# EAGLE design Scheffknecht_input_switch (EAGLE 9.6.2)
BRD_SHEET_NAME: Schaltplan; PROJEKT_NAME: Verstärker_Innovativwoche; REVISION: 1.0; SCH_SHEET_NAME: Input switcher; USER_NAME: Scheffknecht/Melcher-Millner

## Sheet 1 of 3: Input Switch
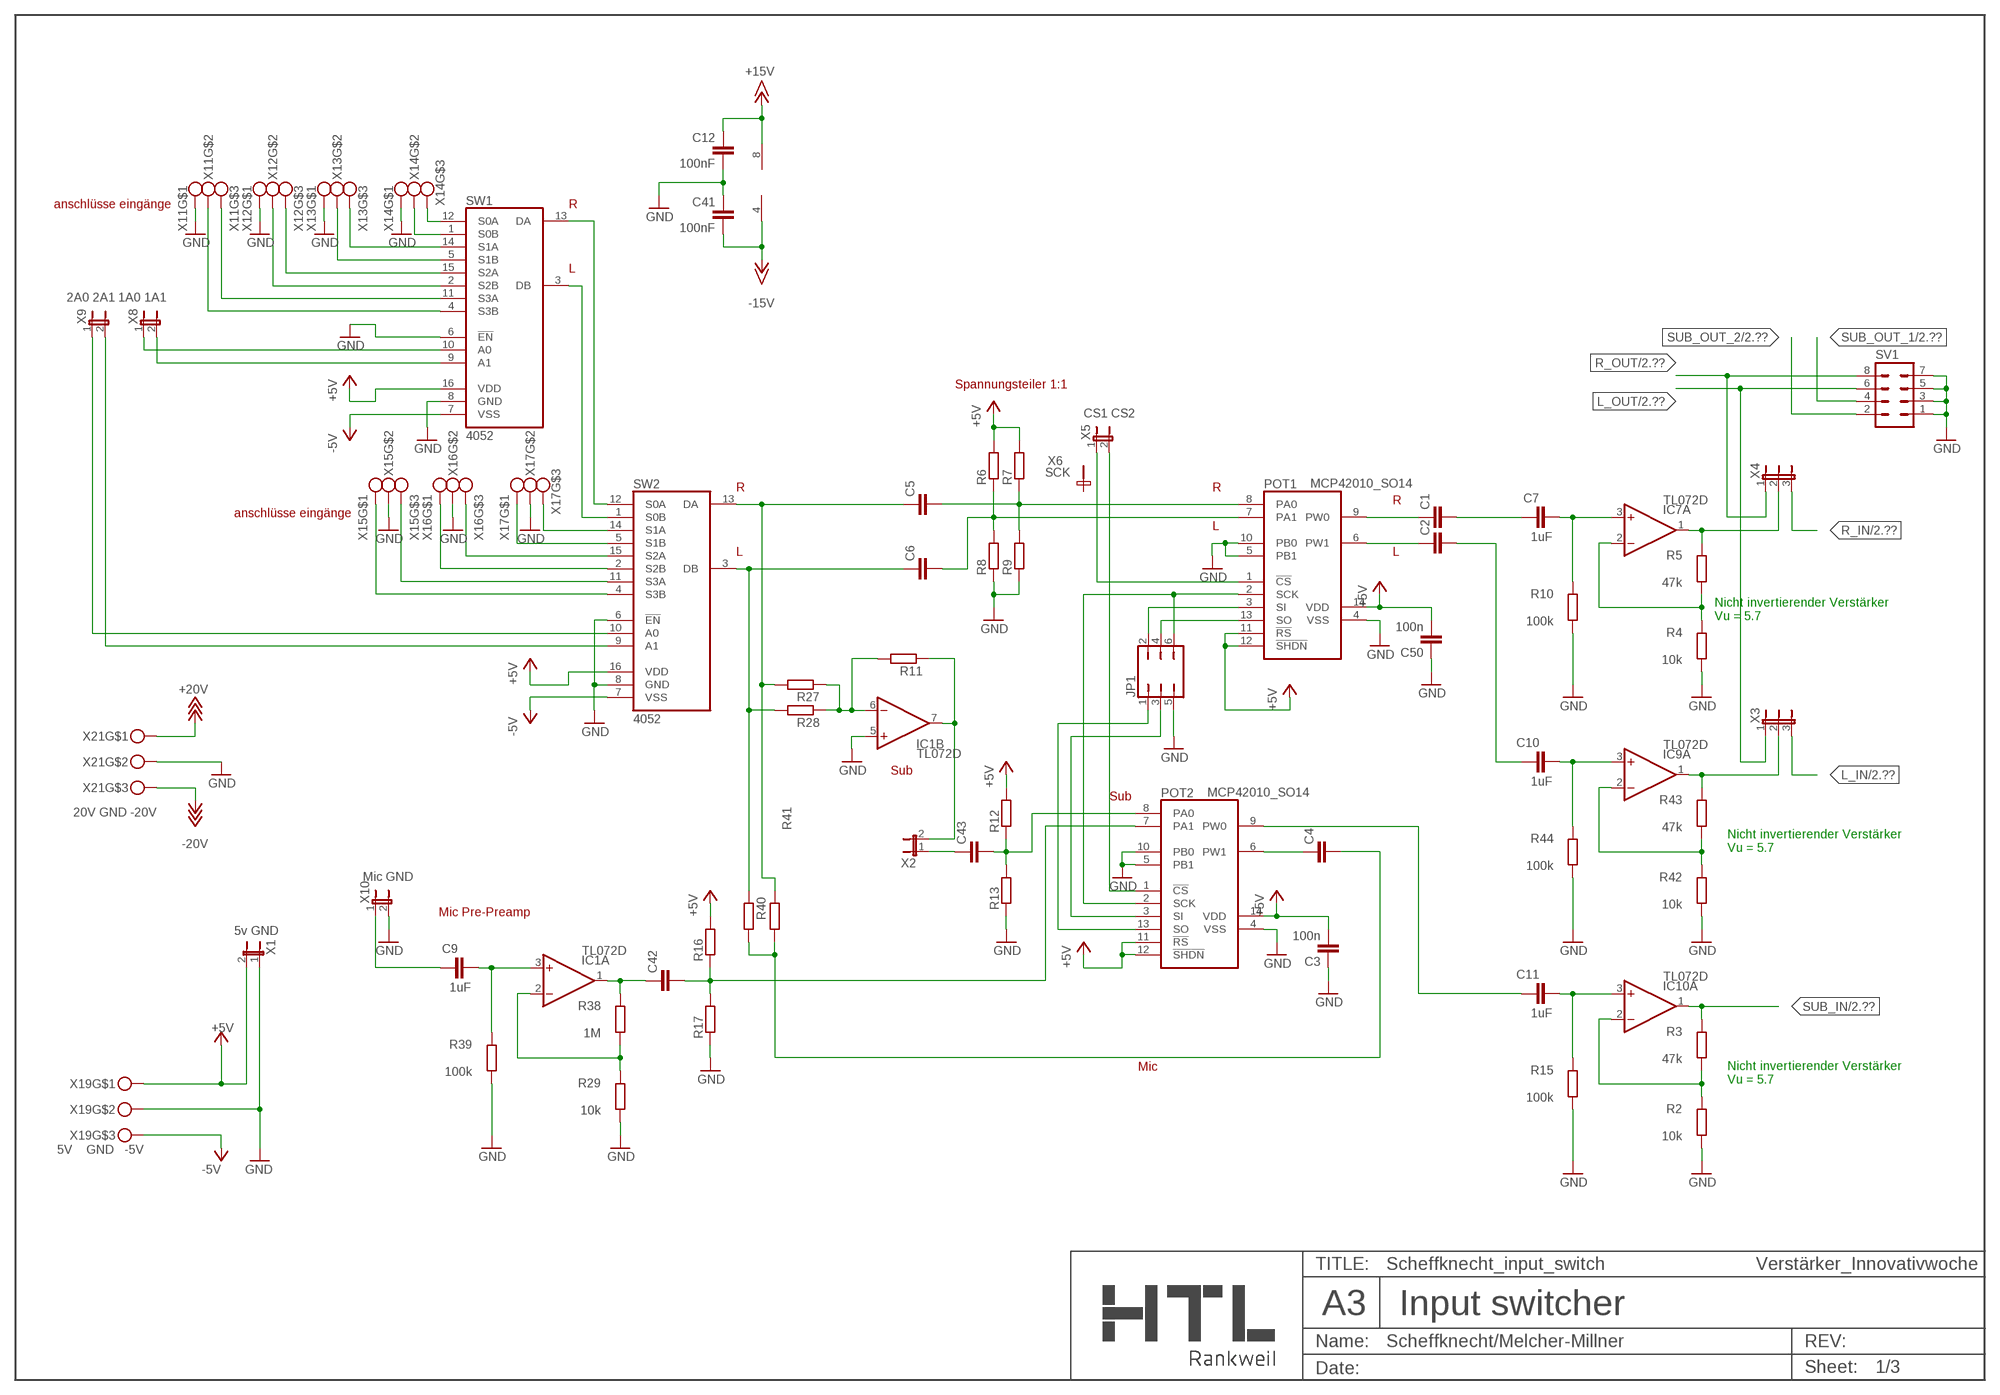
[diagram p0: schematic, sheet 1]

### Parts
C1  C-EUC0805  [C0805]
C2  C-EUC0805  [C0805]
C3  100n  C-EUC0805  [C0805]
C4  C-EUC0805  [C0805]
C5  C-EUC0805  [C0805]
C6  C-EUC0805  [C0805]
C7  1uF  C-EU025-025X050  [C025-025X050]
C9  1uF  C-EU025-025X050  [C025-025X050]
C10  1uF  C-EU025-025X050  [C025-025X050]
C11  1uF  C-EU025-025X050  [C025-025X050]
C12  100nF  C-EUC0805  [C0805]
C41  100nF  C-EUC0805  [C0805]
C42  C-EUC0805  [C0805]
C43  C-EUC0805  [C0805]
C50  100n  C-EUC0805  [C0805]
FRAME1  HTL-A3-H  [HTL-LEER]
IC1  TL072D  [SO08]
IC7  TL072D  [SO08]
IC9  TL072D  [SO08]
IC10  TL072D  [SO08]
JP1  JP3Q  [JP3Q]
POT1  MCP42010_SO14  [SO14]
POT2  MCP42010_SO14  [SO14]
R2  10k  R-EU_M0805  [M0805]
R3  47k  R-EU_M0805  [M0805]
R4  10k  R-EU_M0805  [M0805]
R5  47k  R-EU_M0805  [M0805]
R6  R-EU_M0805  [M0805]
R7  R-EU_M0805  [M0805]
R8  R-EU_M0805  [M0805]
R9  R-EU_M0805  [M0805]
R10  100k  R-EU_M0805  [M0805]
R11  R-EU_M0805  [M0805]
R12  R-EU_M0805  [M0805]
R13  R-EU_M0805  [M0805]
R15  100k  R-EU_M0805  [M0805]
R16  R-EU_M0805  [M0805]
R17  R-EU_M0805  [M0805]
R27  R-EU_M0805  [M0805]
R28  R-EU_M0805  [M0805]
R29  10k  R-EU_M0805  [M0805]
R38  1M  R-EU_M0805  [M0805]
R39  100k  R-EU_M0805  [M0805]
R40  R-EU_M0805  [M0805]
R41  R-EU_M0805  [M0805]
R42  10k  R-EU_M0805  [M0805]
R43  47k  R-EU_M0805  [M0805]
R44  100k  R-EU_M0805  [M0805]
SV1  MA04-2  [MA04-2]
SW1  4052  5042_SO16_NEU  [SO-16]
SW2  4052  5042_SO16_NEU  [SO-16]
X1  5v GND  JMP2  [JMP2]
X2  JMP2  [JMP2]
X3  JMP3  [JMP3]
X4  JMP3  [JMP3]
X5  CS1 CS2  JMP2  [JMP2]
X6  SCK  PIN1  [PIN1]
X8  1A0 1A1  JMP2  [JMP2]
X9  2A0 2A1  JMP2  [JMP2]
X10  Mic GND  JMP2  [JMP2]
X11  MKDS3/3_5,08  [MKDS3/3_5,08]
X12  MKDS3/3_5,08  [MKDS3/3_5,08]
X13  MKDS3/3_5,08  [MKDS3/3_5,08]
X14  MKDS3/3_5,08  [MKDS3/3_5,08]
X15  MKDS3/3_5,08  [MKDS3/3_5,08]
X16  MKDS3/3_5,08  [MKDS3/3_5,08]
X17  MKDS3/3_5,08  [MKDS3/3_5,08]
X19  5V GND -5V  MKDS3/3_5,08  [MKDS3/3_5,08]
X21  20V GND -20V  MKDS3/3_5,08  [MKDS3/3_5,08]

### Nets
+5V: C3.2 C50.2 POT1.11(!RS) POT1.12(!SHDN) POT1.14(VDD) POT2.11(!RS) POT2.12(!SHDN) POT2.14(VDD) R6.2 R7.2 R12.2 R16.2 SW1.16(VDD) SW2.16(VDD) X1.2 X19.P$1 ; also sheet 3
+15V: C12.1 IC1.8(P:V+) ; also sheet 2,3
+18V: X21.P$1 ; supply symbol labelled +20V ; also sheet 3
-5V: SW1.7(VSS) SW2.7(VSS) X19.P$3 ; also sheet 3
-15V: C41.2 IC1.4(P:V-) ; also sheet 2,3
-18V: X21.P$3 ; supply symbol labelled -20V ; also sheet 3
GND: C3.1 C12.2 C41.1 C50.1 IC1.5(B:+IN) JP1.5 POT1.4(VSS) POT1.5(PB1) POT1.10(PB0) POT2.4(VSS) POT2.5(PB1) POT2.10(PB0) R2.1 R4.1 R8.1 R9.1 R10.1 R13.1 R15.1 R17.1 R29.1 R39.1 R42.1 R44.1 SV1.1 SV1.3 SV1.5 SV1.7 SW1.6(!EN) SW1.8(GND) SW2.6(!EN) SW2.8(GND) X1.1 X10.2 X11.P$1 X12.P$1 X13.P$1 X14.P$1 X15.P$2 X16.P$2 X17.P$2 X19.P$2 X21.P$2 ; also sheet 2,3
L_IN: X3.3 ; also sheet 2
L_OUT: SV1.6 X3.1 ; also sheet 2
N$1: POT2.1(!CS) X5.2
N$2: POT1.1(!CS) X5.1
N$3: SW1.3(DB) SW2.1(S0B)
N$4: SW1.13(DA) SW2.12(S0A)
N$5: SW1.9(A1) X8.2
N$6: SW1.10(A0) X8.1
N$7: SW2.9(A1) X9.2
N$8: SW2.10(A0) X9.1
N$9: C5.2 POT1.8(PA0) R7.1 R9.2
N$10: JP1.2 POT1.3(SI)
N$11: C7.2 IC7.3(A:+IN) R10.2
N$12: C5.1 R27.2 R41.1 SW2.13(DA)
N$13: C6.1 R28.2 R40.1 SW2.3(DB)
N$14: C2.2 C10.1
N$15: C10.2 IC9.3(A:+IN) R44.2
N$16: IC1.6(B:-IN) R11.2 R27.1 R28.1
N$17: IC9.2(A:-IN) R42.2 R43.1
N$18: C1.1 POT1.9(PW0)
N$19: C6.2 POT1.7(PA1) R6.1 R8.2
N$20: C11.1 POT2.9(PW0)
N$21: C1.2 C7.1
N$23: C11.2 IC10.3(A:+IN) R15.2
N$24: IC10.2(A:-IN) R2.2 R3.1
N$26: JP1.1 POT2.13(SO)
N$27: C2.1 POT1.6(PW1)
N$28: IC7.2(A:-IN) R4.2 R5.1
N$29: C43.2 POT2.8(PA0) R12.1 R13.2
N$30: C9.1 X10.1
N$31: JP1.4 POT1.13(SO)
N$32: JP1.3 POT2.3(SI)
N$34: C4.1 POT2.6(PW1)
N$35: IC1.7(B:OUT) R11.1 X2.2
N$36: C42.2 POT2.7(PA1) R16.1 R17.2
N$37: JP1.6 POT1.2(SCK) POT2.2(SCK)
N$38: SW1.12(S0A) X14.P$3
N$39: SW1.1(S0B) X14.P$2
N$40: SW1.14(S1A) X13.P$3
N$41: SW1.5(S1B) X13.P$2
N$42: SW1.15(S2A) X12.P$3
N$43: SW1.2(S2B) X12.P$2
N$44: SW1.11(S3A) X11.P$3
N$45: SW1.4(S3B) X11.P$2
N$46: SW2.14(S1A) X17.P$3
N$47: SW2.5(S1B) X17.P$1
N$48: SW2.15(S2A) X16.P$3
N$49: SW2.2(S2B) X16.P$1
N$50: SW2.11(S3A) X15.P$3
N$51: SW2.4(S3B) X15.P$1
N$53: C9.2 IC1.3(A:+IN) R39.2
N$54: IC9.1(A:OUT) R43.2 X3.2
N$55: IC7.1(A:OUT) R5.2 X4.2
N$62: IC1.2(A:-IN) R29.2 R38.1
N$64: C43.1 X2.1
N$71: C42.1 IC1.1(A:OUT) R38.2
N$72: C4.2 R40.2 R41.2
R_IN: X4.3 ; also sheet 2
R_OUT: SV1.8 X4.1 ; also sheet 2
SUB_IN: IC10.1(A:OUT) R3.2 ; also sheet 2
SUB_OUT_1: SV1.4 ; also sheet 2
SUB_OUT_2: SV1.2 ; also sheet 2
Unconnected: IC7.5(B:+IN) IC7.6(B:-IN) IC7.7(B:OUT) IC9.5(B:+IN) IC9.6(B:-IN) IC9.7(B:OUT) IC10.5(B:+IN) IC10.6(B:-IN) IC10.7(B:OUT) X6.P$2(KL1)

### Notes on the sheet
- anschlüsse eingänge | R
- L
- Spannungsteiler 1:1
- R | R
- R
- anschlüsse eingänge
- L
- L | L
- Nicht invertierender Verstärker
  Vu = 5.7
- Sub
- Sub
- Nicht invertierender Verstärker
  Vu = 5.7
- Mic Pre-Preamp
- Mic
- Nicht invertierender Verstärker
  Vu = 5.7

## Sheet 2 of 3: Aktivfilter
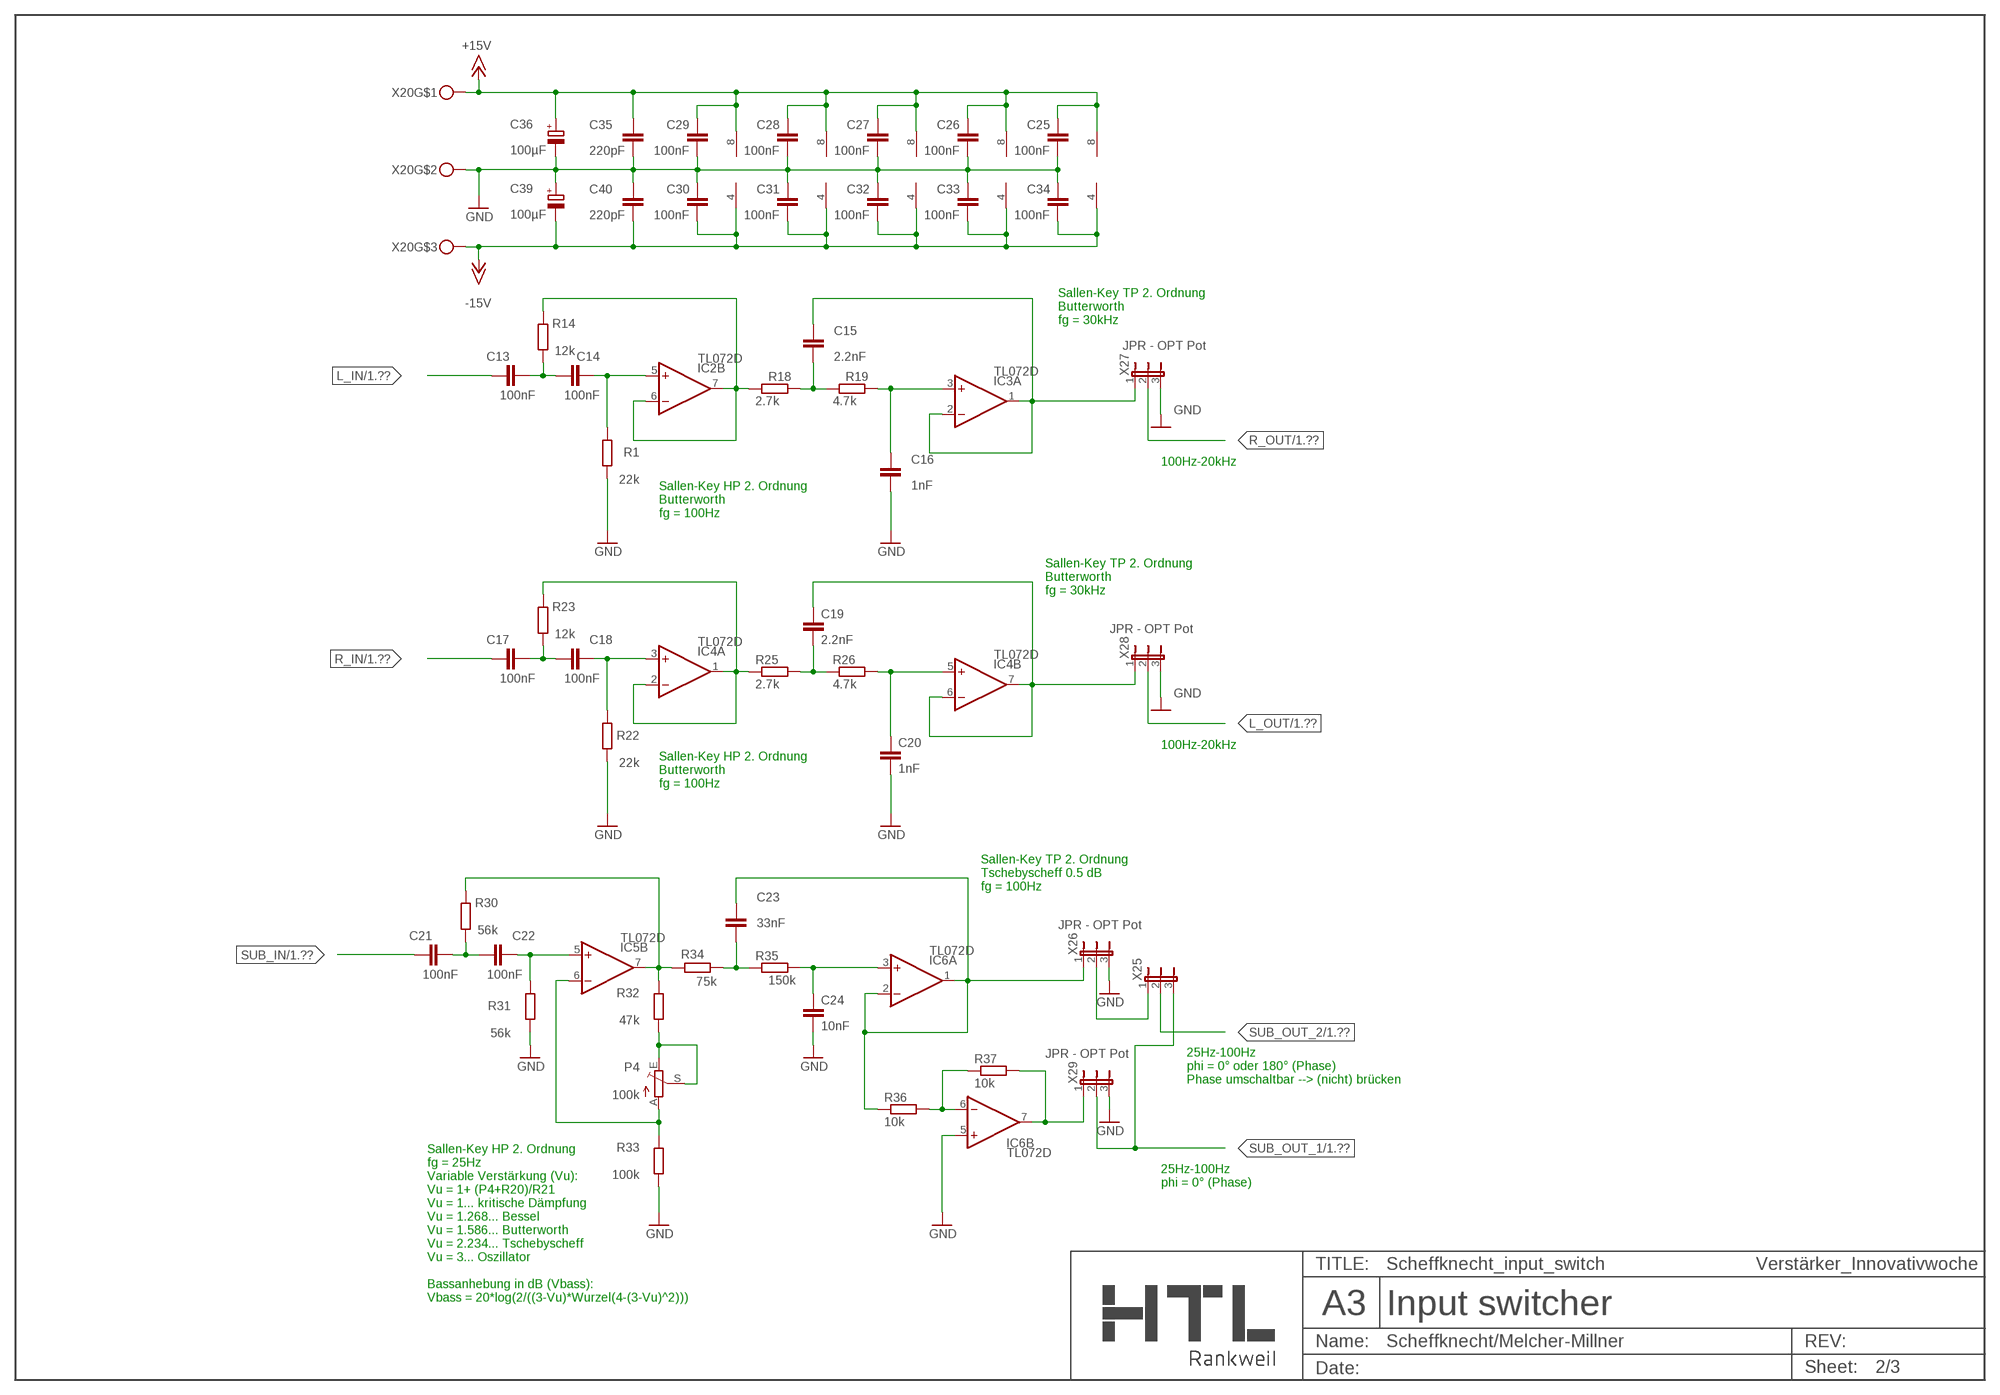
[diagram p1: schematic, sheet 2]

### Parts
C13  100nF  C-EUC0805  [C0805]
C14  100nF  C-EUC0805  [C0805]
C15  2.2nF  C-EUC0805  [C0805]
C16  1nF  C-EUC0805  [C0805]
C17  100nF  C-EUC0805  [C0805]
C18  100nF  C-EUC0805  [C0805]
C19  2.2nF  C-EUC0805  [C0805]
C20  1nF  C-EUC0805  [C0805]
C21  100nF  C-EUC0805  [C0805]
C22  100nF  C-EUC0805  [C0805]
C23  33nF  C-EUC0805  [C0805]
C24  10nF  C-EUC0805  [C0805]
C25  100nF  C-EUC0805  [C0805]
C26  100nF  C-EUC0805  [C0805]
C27  100nF  C-EUC0805  [C0805]
C28  100nF  C-EUC0805  [C0805]
C29  100nF  C-EUC0805  [C0805]
C30  100nF  C-EUC0805  [C0805]
C31  100nF  C-EUC0805  [C0805]
C32  100nF  C-EUC0805  [C0805]
C33  100nF  C-EUC0805  [C0805]
C34  100nF  C-EUC0805  [C0805]
C35  220pF  C-EUC0805  [C0805]
C36  100µF  CPOL-EUE2.5-6  [E2,5-6]
C39  100µF  CPOL-EUE2.5-6  [E2,5-6]
C40  220pF  C-EUC0805  [C0805]
FRAME2  HTL-A3-H  [HTL-LEER]
IC2  TL072D  [SO08]
IC3  TL072D  [SO08]
IC4  TL072D  [SO08]
IC5  TL072D  [SO08]
IC6  TL072D  [SO08]
P4  100k  TRIM_EU-S64W  [S64W]
R1  22k  R-EU_M0805  [M0805]
R14  12k  R-EU_M0805  [M0805]
R18  2.7k  R-EU_M0805  [M0805]
R19  4.7k  R-EU_M0805  [M0805]
R22  22k  R-EU_M0805  [M0805]
R23  12k  R-EU_M0805  [M0805]
R25  2.7k  R-EU_M0805  [M0805]
R26  4.7k  R-EU_M0805  [M0805]
R30  56k  R-EU_M0805  [M0805]
R31  56k  R-EU_M0805  [M0805]
R32  47k  R-EU_M0805  [M0805]
R33  100k  R-EU_M0805  [M0805]
R34  75k  R-EU_M0805  [M0805]
R35  150k  R-EU_M0805  [M0805]
R36  10k  R-EU_M0805  [M0805]
R37  10k  R-EU_M0805  [M0805]
X20  MKDS3/3_5,08  [MKDS3/3_5,08]
X25  JMP3  [JMP3]
X26  JMP3  [JMP3]
X27  JMP3  [JMP3]
X28  JMP3  [JMP3]
X29  JMP3  [JMP3]

### Nets
+15V: C25.1 C26.1 C27.1 C28.1 C29.1 C35.1 C36.+ IC2.8(P:V+) IC3.8(P:V+) IC4.8(P:V+) IC5.8(P:V+) IC6.8(P:V+) X20.P$1 ; also sheet 1,3
-15V: C30.2 C31.2 C32.2 C33.2 C34.2 C39.- C40.2 IC2.4(P:V-) IC3.4(P:V-) IC4.4(P:V-) IC5.4(P:V-) IC6.4(P:V-) X20.P$3 ; also sheet 1,3
GND: C16.2 C20.2 C24.2 IC6.5(B:+IN) R1.1 R22.1 R31.1 R33.1 X26.3 X27.3 X28.3 X29.3 ; also sheet 1,3
GND1: C25.2 C26.2 C27.2 C28.2 C29.2 C30.1 C31.1 C32.1 C33.1 C34.1 C35.2 C36.- C39.+ C40.1 X20.P$2 ; supply symbol labelled GND
L_IN: C13.1 ; also sheet 1
L_OUT: X28.2 ; also sheet 1
N$56: IC2.6(B:-IN) IC2.7(B:OUT) R14.2 R18.1
N$57: C14.2 IC2.5(B:+IN) R1.2
N$58: C13.2 C14.1 R14.1
N$59: C15.2 R18.2 R19.1
N$60: C16.1 IC3.3(A:+IN) R19.2
N$61: C15.1 IC3.1(A:OUT) IC3.2(A:-IN) X27.1
N$65: IC4.1(A:OUT) IC4.2(A:-IN) R23.2 R25.1
N$66: C18.2 IC4.3(A:+IN) R22.2
N$67: C17.2 C18.1 R23.1
N$68: C19.2 R25.2 R26.1
N$69: C20.1 IC4.5(B:+IN) R26.2
N$70: C19.1 IC4.6(B:-IN) IC4.7(B:OUT)
N$73: C21.2 C22.1 R30.1
N$74: C22.2 IC5.5(B:+IN) R31.2
N$75: IC5.7(B:OUT) R30.2 R32.2 R34.2
N$76: IC5.6(B:-IN) P4.A R33.2
N$77: P4.E P4.S R32.1
N$78: C24.1 IC6.3(A:+IN) R35.2
N$79: C23.2 R34.1 R35.1
N$80: IC6.6(B:-IN) R36.2 R37.1
N$81: X25.1 X26.2
N$84: X28.1
R_IN: C17.1 ; also sheet 1
R_OUT: X27.2 ; also sheet 1
SUB_IN: C21.1 ; also sheet 1
SUB_OUT: IC6.7(B:OUT) R37.2 X29.1
SUB_OUT-180: C23.1 IC6.1(A:OUT) IC6.2(A:-IN) R36.1 X26.1
SUB_OUT_1: X25.3 X29.2 ; also sheet 1
SUB_OUT_2: X25.2 ; also sheet 1
Unconnected: IC2.1(A:OUT) IC2.2(A:-IN) IC2.3(A:+IN) IC3.5(B:+IN) IC3.6(B:-IN) IC3.7(B:OUT) IC5.1(A:OUT) IC5.2(A:-IN) IC5.3(A:+IN)

### Notes on the sheet
- Sallen-Key TP 2. Ordnung
  Butterworth
  fg = 30kHz
- JPR - OPT Pot
- 100Hz-20kHz
- Sallen-Key HP 2. Ordnung
  Butterworth
  fg = 100Hz
- Sallen-Key TP 2. Ordnung
  Butterworth
  fg = 30kHz
- JPR - OPT Pot
- 100Hz-20kHz
- Sallen-Key HP 2. Ordnung
  Butterworth
  fg = 100Hz
- Sallen-Key TP 2. Ordnung
  Tschebyscheff 0.5 dB
  fg = 100Hz
- JPR - OPT Pot
- JPR - OPT Pot
- 25Hz-100Hz
  phi = 0° oder 180° (Phase) 
  Phase umschaltbar --> (nicht) brücken
- 25Hz-100Hz
  phi = 0° (Phase)
- Sallen-Key HP 2. Ordnung
  fg = 25Hz
  Variable Verstärkung (Vu): 
  Vu = 1+ (P4+R20)/R21
  Vu = 1... kritische Dämpfung
  Vu = 1.268... Bessel
  Vu = 1.586... Butterworth
  Vu = 2.234... Tschebyscheff
  Vu = 3... Oszillator
  
  Bassanhebung in dB (Vbass):
  Vbass = 20*log(2/((3-Vu)*Wurzel(4-(3-Vu)^2)))

## Sheet 3 of 3: Spannungsregler
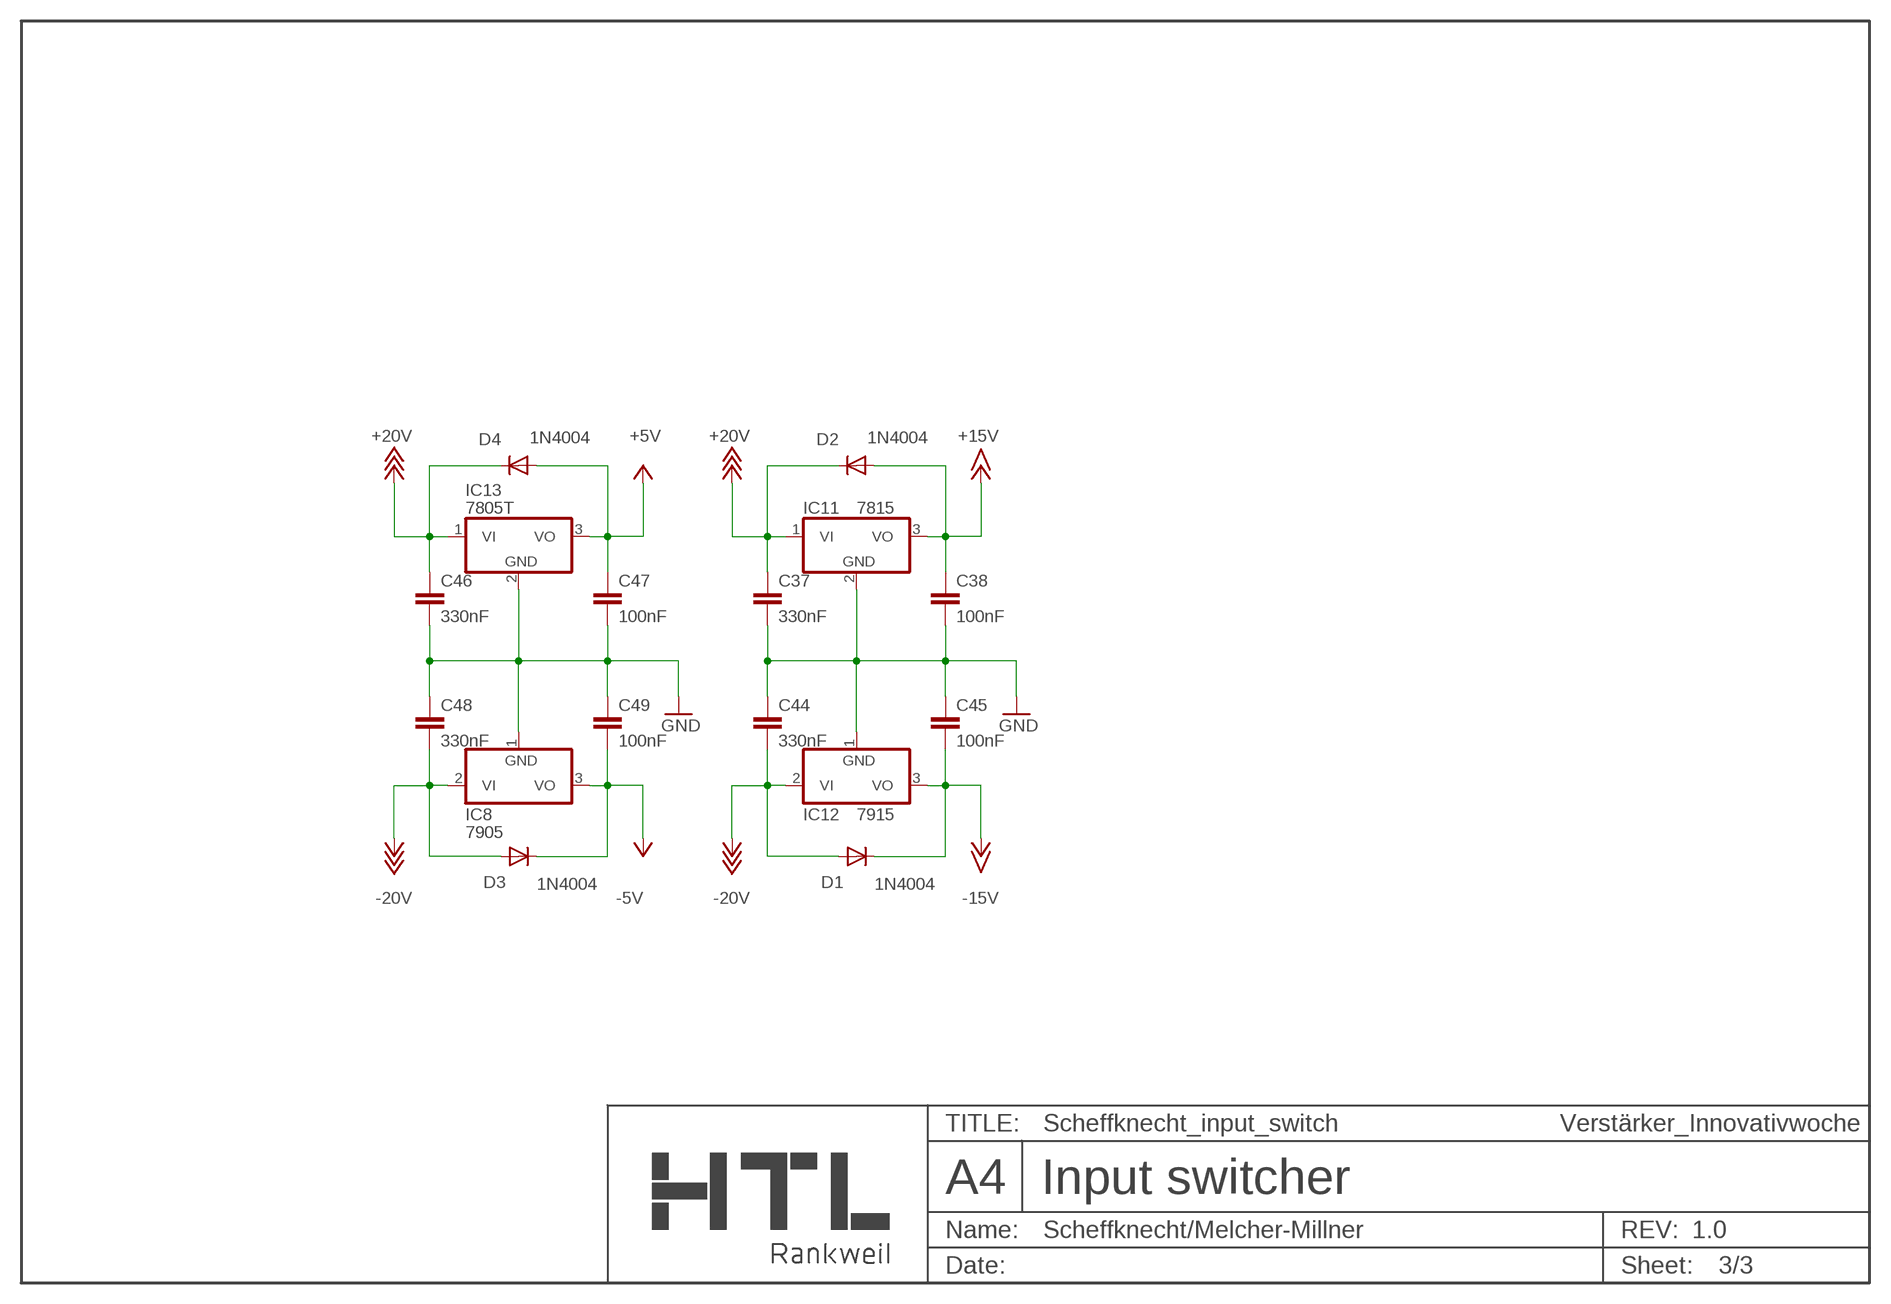
[diagram p2: schematic, sheet 3]

### Parts
C37  330nF  C-EUC0805  [C0805]
C38  100nF  C-EUC0805  [C0805]
C44  330nF  C-EUC0805  [C0805]
C45  100nF  C-EUC0805  [C0805]
C46  330nF  C-EUC0805  [C0805]
C47  100nF  C-EUC0805  [C0805]
C48  330nF  C-EUC0805  [C0805]
C49  100nF  C-EUC0805  [C0805]
D1  1N4004  [DO41-10]
D2  1N4004  [DO41-10]
D3  1N4004  [DO41-10]
D4  1N4004  [DO41-10]
FRAME3  HTL-A4-H  [HTL-LEER]
IC8  7905  7905T  [TO220H]
IC11  7815  7815T  [TO220H]
IC12  7915  7915T  [TO220H]
IC13  7805T  [TO220H]

### Nets
+5V: C47.1 D4.A IC13.3(VO) ; also sheet 1
+15V: C38.1 D2.A IC11.3(VO) ; also sheet 1,2
+18V: C37.1 C46.1 D2.C D4.C IC11.1(VI) IC13.1(VI) ; supply symbol labelled +20V ; also sheet 1
-5V: C49.2 D3.C IC8.3(VO) ; also sheet 1
-15V: C45.2 D1.C IC12.3(VO) ; also sheet 1,2
-18V: C44.2 C48.2 D1.A D3.A IC8.2(VI) IC12.2(VI) ; supply symbol labelled -20V ; also sheet 1
GND: C37.2 C38.2 C44.1 C45.1 C46.2 C47.2 C48.1 C49.1 IC8.1(GND) IC11.2(GND) IC12.1(GND) IC13.2(GND) ; also sheet 1,2

## Power pins joined to a net without a drawn wire
V+: IC7.8(P:V+) IC9.8(P:V+) IC10.8(P:V+)
V-: IC7.4(P:V-) IC9.4(P:V-) IC10.4(P:V-)

## Library data of the parts
C1-C6 C12-C35 C37 C38 C40-C50 = rcl:C-EU: CAPACITOR, European symbol
C7 C9-C11 = resistor:C-EU: CAPACITOR, European symbol
C36 C39 = rcl:CPOL-EU: POLARIZED CAPACITOR, European symbol
D1-D4 = diode:1N4004: DIODE general purpose rectifier, 1 A
FRAME1 FRAME2 = 0_HTL_frame:HTL-A3-H: Arbeitsblatt der HTL Rankweil für Schaltpläne DIN-A3 Landscape kombinierbar mit Boardplänen (CHANGE PACKAGE): DIN-A3 Landscape DIN-A3 Portrait DIN-A4 Landscape DIN-A4 Portrait Leer (für Projekte mit mehreren Schaltplänen und einem Board) Über Attribute werden die Beschriftungeinträge gesteuert: Attribut USER_NAME ( Schaltplan + Board) PROJEKT_NAME ( Schaltplan + Board) ACCOUNT_NAME ( Schaltplan + Board) REVISION ( Schaltplan + Board) SCH_SHEET_NAME ( Schaltplan) BRD_SHEET_NAME ( Board)
FRAME3 = 0_HTL_frame:HTL-A4-H: Arbeitsblatt der HTL Rankweil für Schaltpläne DIN-A4 Landscape kombinierbar mit Boardplänen (CHANGE PACKAGE): DIN-A3 Landscape DIN-A3 Portrait DIN-A4 Landscape DIN-A4 Portrait Leer (für Projekte mit mehreren Schaltplänen und einem Board) Über Attribute werden die Beschriftungeinträge gesteuert: Attribut USER_NAME ( Schaltplan + Board) PROJEKT_NAME ( Schaltplan + Board) ACCOUNT_NAME ( Schaltplan + Board) REVISION ( Schaltplan + Board) SCH_SHEET_NAME ( Schaltplan) BRD_SHEET_NAME ( Board)
IC1-IC7 IC9 IC10 = linear:TL072: OP AMP
IC8 IC12 = linear:79*: Negative VOLTAGE REGULATOR
IC11 IC13 = linear:78*: Positive VOLTAGE REGULATOR Source: http://cache.national.com/ds/LM/LM78L05.pdf http://www.fairchildsemi.com/ds/LM/LM7805.pdf
JP1 = jumper:JP3Q: JUMPER
P4 = pot:TRIM_EU-: POTENTIOMETER
POT1 POT2 = 0_Custom-Lib_Verstärker:MCP42010_SO14
R1-R19 R22 R23 R25-R44 = rcl:R-EU_: RESISTOR, European symbol
SV1 = con-lstb:MA04-2: PIN HEADER; OC_FARNELL: unknown; OC_NEWARK: unknown
SW1 SW2 = 0_Custom-Lib_Verstärker:5042_SO16_NEU
X1 X2 X5 X8-X10 = 0_HTL_elektro:JMP2: Jumper 2-polig
X3 X4 X25-X29 = 0_HTL_elektro:JMP3: Jumper 3-polig
X6 = 0_HTL_uC-MEGACARD:PIN1
X11-X17 X19-X21 = 0_HTL_elektro:MKDS3/3_5,08: Leiterplattenklemme 3-polig

## Board
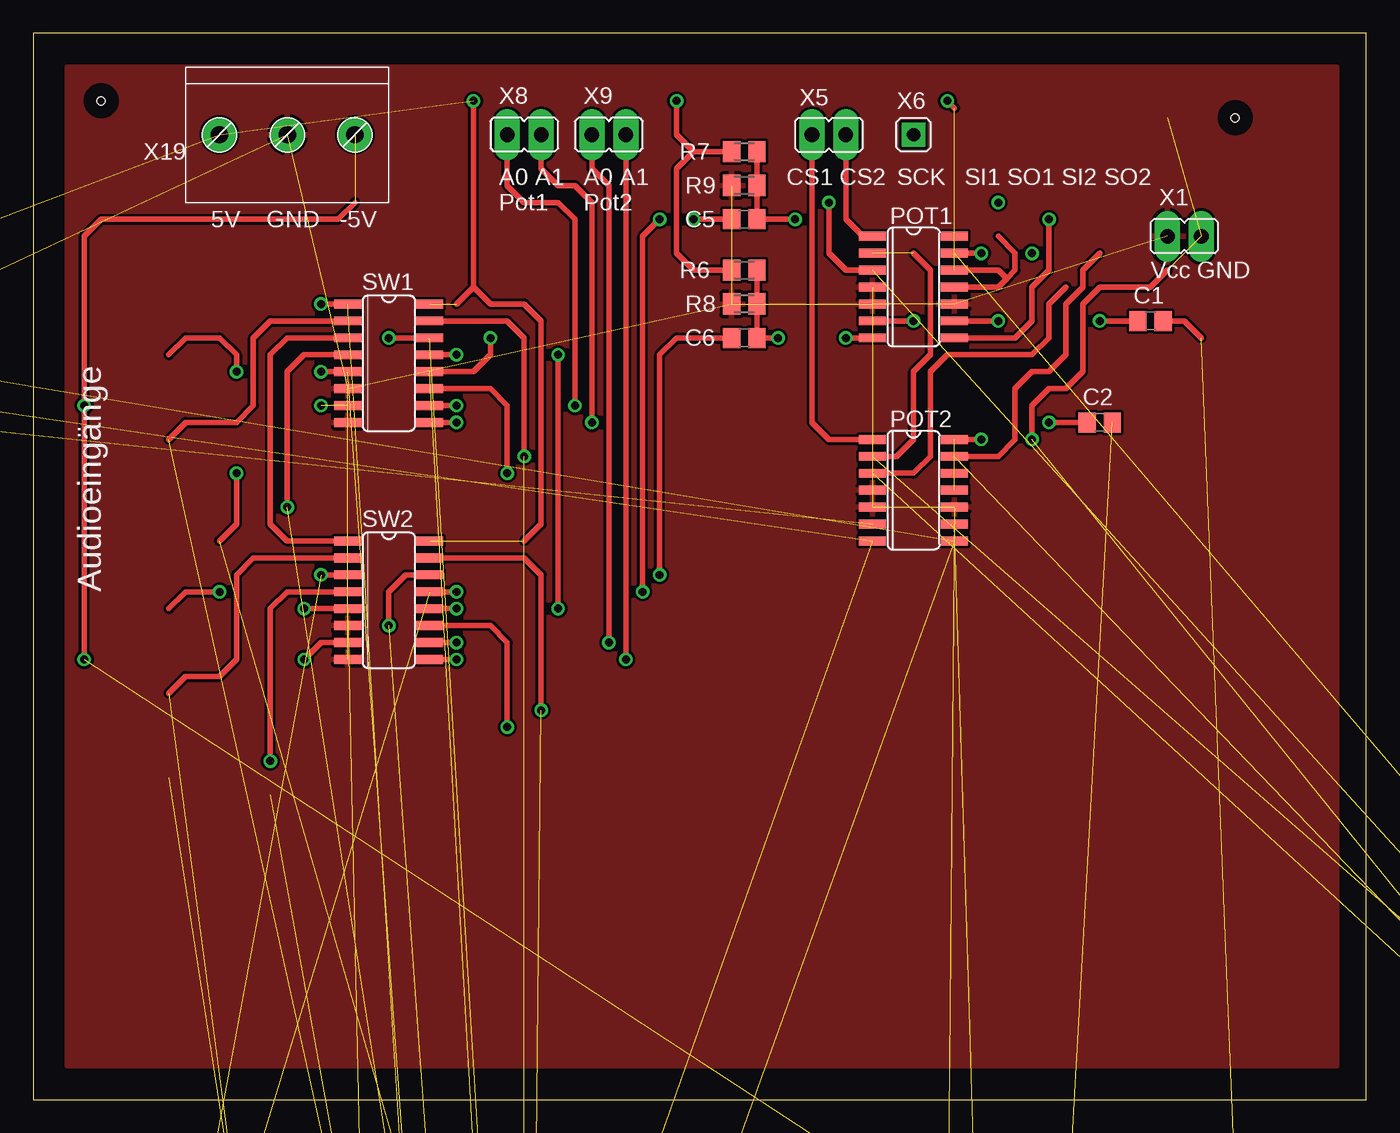
[diagram p3: board, top side]
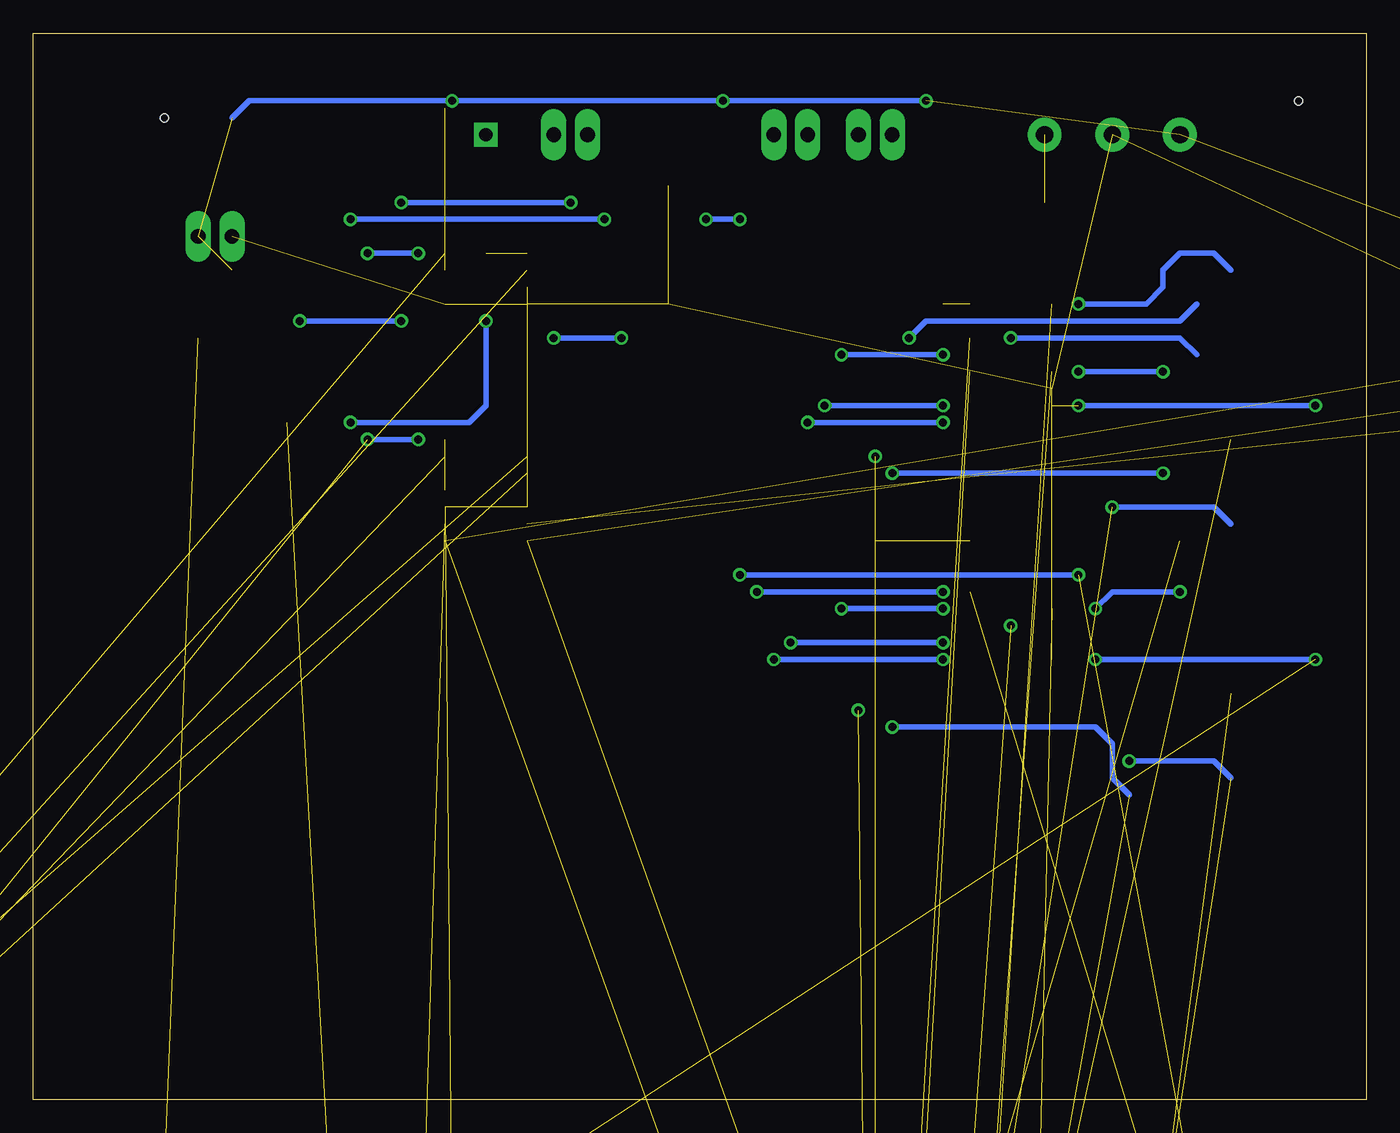
[diagram p4: board, bottom side, seen from below]

Size 100 x 80 mm. Coordinates in mm from the lower left corner, seen from the top.
Outline: 0,0 100,0 100,80 0,80 0,0
Copper layers (1*16): Top 0.035mm / dielectric 1.5mm / Bottom 0.035mm
Design rules "default": minimum track width 10mil, minimum drill 0.6mm, track to track 8mil, track to pad 8mil, pad to pad 8mil, via to via 8mil, smd to smd 8mil, copper to edge 40mil, drill to drill 8mil, minimum pad ring 10mil, minimum via ring 8mil, stop-mask expansion 4mil, vias tented up to drill 0mil, thermal gap 10mil
Holes 0.6 mm at 5.08,74.93 90.17,73.66

### Footprints (pad centres in the part's own frame; a part is rotated, then mirrored left to right if it is on the bottom)
C0805 = smd 1.3 x 1.5: 1 -0.95,0; 2 0.95,0
C025-025X050 = drill 0.813 octagon: 1 -1.27,0; 2 1.27,0
E2,5-6 = drill 0.813 pad 1.6: + -1.27,0 | drill 0.813 pad 1.6 octagon: - 1.27,0
DO41-10 = drill 1.118: A 5.08,0; C -5.08,0
SO08 = smd 0.6 x 2.2: 1 -1.905,-2.6; 2 -0.635,-2.6; 3 0.635,-2.6; 4 1.905,-2.6; 5 1.905,2.6; 6 0.635,2.6; 7 -0.635,2.6; 8 -1.905,2.6
TO220H = drill 1.118 long: 1 -2.54,-10.16; 2 0,-10.16; 3 2.54,-10.16 | hole 3.302: 0,4.826
JP3Q = drill 0.914 octagon: 1 -2.54,-1.27; 2 -2.54,1.27; 3 0,-1.27; 4 0,1.27; 5 2.54,-1.27; 6 2.54,1.27
S64W = drill 0.813 long: A 2.54,1.27; E -2.54,1.27; S 0,1.27
SO14 = smd 0.66 x 2.032: 1 -3.81,-3.073; 2 -2.54,-3.073; 3 -1.27,-3.073; 4 0,-3.073; 5 1.27,-3.073; 6 2.54,-3.073; 7 3.81,-3.073; 8 3.81,3.073; 9 2.54,3.073; 10 1.27,3.073; 11 0,3.073; 12 -1.27,3.073; 13 -2.54,3.073; 14 -3.81,3.073
M0805 = smd 1.3 x 1.6: 1 -0.95,0; 2 0.95,0
MA04-2 = drill 1.016 octagon: 1 -3.81,-1.27; 2 -3.81,1.27; 3 -1.27,-1.27; 4 -1.27,1.27; 5 1.27,-1.27; 6 1.27,1.27; 7 3.81,-1.27; 8 3.81,1.27
SO-16 = smd 0.66 x 2.032: 1 -4.445,-3.073; 2 -3.175,-3.073; 3 -1.905,-3.073; 4 -0.635,-3.073; 5 0.635,-3.073; 6 1.905,-3.073; 7 3.175,-3.073; 8 4.445,-3.073; 9 4.445,3.073; 10 3.175,3.073; 11 1.905,3.073; 12 0.635,3.073; 13 -0.635,3.073; 14 -1.905,3.073; 15 -3.175,3.073; 16 -4.445,3.073
JMP2 = drill 1.1 pad 1.93 long: 1 0,-1.27; 2 0,1.27
JMP3 = drill 1.1 pad 1.93 long: 1 -2.54,0; 2 0,0; 3 2.54,0
PIN1 = drill 1 pad 1.778 square: P$2 -1.27,0
MKDS3/3_5,08 = drill 1.3 pad 2.54: P$1 -5.08,0; P$2 0,0; P$3 5.08,0

### Placement (x,y rotation side)
C1  83.82,58.42 0 top
C2  80.01,50.8 0 top
C3  not placed on the board
C4  not placed on the board
C5  53.34,66.04 0 top
C6  53.34,57.15 0 top
C7  not placed on the board
C9  not placed on the board
C10  not placed on the board
C11  not placed on the board
C12  not placed on the board
C13  not placed on the board
C14  not placed on the board
C15  not placed on the board
C16  not placed on the board
C17  not placed on the board
C18  not placed on the board
C19  not placed on the board
C20  not placed on the board
C21  not placed on the board
C22  not placed on the board
C23  not placed on the board
C24  not placed on the board
C25  not placed on the board
C26  not placed on the board
C27  not placed on the board
C28  not placed on the board
C29  not placed on the board
C30  not placed on the board
C31  not placed on the board
C32  not placed on the board
C33  not placed on the board
C34  not placed on the board
C35  not placed on the board
C36  not placed on the board
C37  not placed on the board
C38  not placed on the board
C39  not placed on the board
C40  not placed on the board
C41  not placed on the board
C42  not placed on the board
C43  not placed on the board
C44  not placed on the board
C45  not placed on the board
C46  not placed on the board
C47  not placed on the board
C48  not placed on the board
C49  not placed on the board
C50  not placed on the board
D1  not placed on the board
D2  not placed on the board
D3  not placed on the board
D4  not placed on the board
FRAME1  not placed on the board
FRAME2  not placed on the board
FRAME3  not placed on the board
IC1  not placed on the board
IC2  not placed on the board
IC3  not placed on the board
IC4  not placed on the board
IC5  not placed on the board
IC6  not placed on the board
IC7  not placed on the board
IC8  not placed on the board
IC9  not placed on the board
IC10  not placed on the board
IC11  not placed on the board
IC12  not placed on the board
IC13  not placed on the board
JP1  not placed on the board
P4  not placed on the board
POT1  66.04,60.96 270 top
POT2  66.04,45.72 270 top
R1  not placed on the board
R2  not placed on the board
R3  not placed on the board
R4  not placed on the board
R5  not placed on the board
R6  53.34,62.23 180 top
R7  53.34,71.12 180 top
R8  53.34,59.69 0 top
R9  53.34,68.58 0 top
R10  not placed on the board
R11  not placed on the board
R12  not placed on the board
R13  not placed on the board
R14  not placed on the board
R15  not placed on the board
R16  not placed on the board
R17  not placed on the board
R18  not placed on the board
R19  not placed on the board
R22  not placed on the board
R23  not placed on the board
R25  not placed on the board
R26  not placed on the board
R27  not placed on the board
R28  not placed on the board
R29  not placed on the board
R30  not placed on the board
R31  not placed on the board
R32  not placed on the board
R33  not placed on the board
R34  not placed on the board
R35  not placed on the board
R36  not placed on the board
R37  not placed on the board
R38  not placed on the board
R39  not placed on the board
R40  not placed on the board
R41  not placed on the board
R42  not placed on the board
R43  not placed on the board
R44  not placed on the board
SV1  not placed on the board
SW1  26.67,55.24 270 top
SW2  26.67,37.47 270 top
X1  86.36,64.77 270 top
X2  not placed on the board
X3  not placed on the board
X4  not placed on the board
X5  59.69,72.39 90 top
X6  67.31,72.39 0 top
X8  36.83,72.39 270 top
X9  43.18,72.39 270 top
X10  not placed on the board
X11  not placed on the board
X12  not placed on the board
X13  not placed on the board
X14  not placed on the board
X15  not placed on the board
X16  not placed on the board
X17  not placed on the board
X19  19.05,72.39 0 top
X20  not placed on the board
X21  not placed on the board
X25  not placed on the board
X26  not placed on the board
X27  not placed on the board
X28  not placed on the board
X29  not placed on the board

### Tracks (layer width: path | path; a pad name or v marks a point on that pad's centre or on a via)
+5V  (via drill 0.6)  (16 unrouted)
  Top 0.406: POT2.14 v71.12,49.53 | v74.93,49.53 74.93,52.07 76.2,53.34 77.47,53.34 78.74,54.61 78.74,59.69 80.01,60.96 83.82,60.96 85.09,62.23 | POT1.11 72.39,60.96 73.03,61.59 | 73.03,61.59 73.66,62.23 73.66,63.5 72.39,64.77 | POT1.12 72.39,62.23 73.03,61.59 | 33.02,60.96 31.75,59.69 | 36.83,41.91 38.1,43.18 38.1,58.42 36.83,59.69 34.29,59.69 33.02,60.96 | R7.2 49.53,71.12 | 49.53,71.12 48.26,72.39 v48.26,74.93 | 33.02,60.96 v33.02,74.93 | R6.2 49.53,62.23 48.26,63.5 48.26,69.85 49.53,71.12 | 69.11,74.4 v68.58,74.93
  Bottom 0.406: v71.12,49.53 v74.93,49.53 | v33.02,74.93 v48.26,74.93 v68.58,74.93 83.82,74.93 85.09,73.66
+15V  (17 unrouted)
+18V  (6 unrouted)
-5V  (via drill 0.6)  (5 unrouted)
  Top 0.406: v3.81,33.02 v3.81,52.07 3.81,64.77 5.08,66.04 22.86,66.04 24.13,67.31 | v20.32,33.02 21.59,34.29 SW2.7
  Bottom 0.406: v21.59,52.07 v3.81,52.07 | v20.32,33.02 v3.81,33.02
-15V  (17 unrouted)
-18V  (6 unrouted)
GND  (66 unrouted)
  pour Top: 2.54,77.47 2.54,2.54 97.79,2.54 97.79,77.47
GND1  (14 unrouted)
L_IN  (1 unrouted)
L_OUT  (2 unrouted)
N$1
  Top 0.406: X5.2 58.42,50.8 59.69,49.53 POT2.1
N$2
  Top 0.406: X5.1 60.96,66.04 62.23,64.77 POT1.1
N$3
  Top 0.406: SW1.3 19.05,57.15 17.78,55.88 17.78,43.18 19.05,41.91 SW2.1
N$4  (via drill 0.6)
  Top 0.406: SW2.12 v31.75,36.83 | v39.37,36.83 v39.37,55.88 | v31.75,55.88 SW1.13
  Bottom 0.406: v31.75,36.83 v39.37,36.83 | v39.37,55.88 v31.75,55.88
N$5  (via drill 0.6)
  Top 0.406: SW1.9 v31.75,50.8 | v41.91,50.8 41.91,67.31 40.64,68.58 39.37,68.58 38.1,69.85 X8.2
  Bottom 0.406: v31.75,50.8 v41.91,50.8
N$6  (via drill 0.6)
  Top 0.406: SW1.10 v31.75,52.07 | v40.64,52.07 40.64,66.04 39.37,67.31 36.83,67.31 35.56,68.58 X8.1
  Bottom 0.406: v31.75,52.07 v40.64,52.07
N$7  (via drill 0.6)
  Top 0.406: v31.75,33.02 SW2.9 | v44.45,33.02 X9.2
  Bottom 0.406: v44.45,33.02 v31.75,33.02
N$8  (via drill 0.6)
  Top 0.406: SW2.10 v31.75,34.29 | v43.18,34.29 43.18,68.58 41.91,69.85 X9.1
  Bottom 0.406: v31.75,34.29 v43.18,34.29
N$9  (via drill 0.6)
  Top 0.406: R7.1 R9.2 C5.2 v57.15,66.04 | POT1.8 73.66,57.15 74.93,58.42 74.93,60.96 76.2,62.23 v76.2,66.04
  Bottom 0.406: v57.15,66.04 v76.2,66.04
N$10  (via drill 0.6)  (1 unrouted)
  Top 0.406: v59.69,67.31 59.69,63.5 60.96,62.23 POT1.3
  Bottom 0.406: v72.39,67.31 v59.69,67.31
N$11  (2 unrouted)
N$12  (via drill 0.6)  (2 unrouted)
  Top 0.406: SW2.13 v31.75,38.1 | v45.72,38.1 45.72,64.77 v46.99,66.04 | v49.53,66.04 C5.1
  Bottom 0.406: v31.75,38.1 v45.72,38.1 | v46.99,66.04 v49.53,66.04
N$13  (via drill 0.6)  (2 unrouted)
  Top 0.406: SW2.3 v21.59,39.37 | v46.99,39.37 46.99,55.88 48.26,57.15 C6.1
  Bottom 0.406: v21.59,39.37 v46.99,39.37
N$14  (1 unrouted)
N$15  (2 unrouted)
N$16  (3 unrouted)
N$17  (2 unrouted)
N$18  (via drill 0.6)
  Top 0.406: POT1.9 v72.39,58.42 | v80.01,58.42 C1.1
  Bottom 0.406: v72.39,58.42 v80.01,58.42
N$19  (via drill 0.6)
  Top 0.406: R6.1 R8.2 C6.2 v55.88,57.15 | v60.96,57.15 POT1.7
  Bottom 0.406: v55.88,57.15 v60.96,57.15
N$20  (1 unrouted)
N$21  (1 unrouted)
  Top 0.406: C1.2 86.36,58.42 87.63,57.15
N$23  (2 unrouted)
N$24  (2 unrouted)
N$26  (1 unrouted)
  Top 0.406: 80.01,63.5 78.74,62.23 78.74,60.96 77.47,59.69 77.47,55.88 76.2,54.61 74.93,54.61 73.66,53.34 73.66,49.53 72.39,48.26 POT2.13
N$27  (via drill 0.6)
  Top 0.406: POT1.6 v66.04,58.42 | v76.2,50.8 C2.1
  Bottom 0.406: v66.04,58.42 66.04,52.07 67.31,50.8 v76.2,50.8
N$28  (2 unrouted)
N$29  (3 unrouted)
N$30  (1 unrouted)
N$31  (via drill 0.6)  (1 unrouted)
  Top 0.406: v71.12,63.5 POT1.13
  Bottom 0.406: v71.12,63.5 v74.93,63.5
N$32  (1 unrouted)
  Top 0.406: 77.47,60.96 76.2,59.69 76.2,57.15 74.93,55.88 68.58,55.88 67.31,54.61 67.31,48.26 66.04,46.99 POT2.3
N$34  (1 unrouted)
N$35  (2 unrouted)
N$36  (3 unrouted)
N$37  (2 unrouted)
  Top 0.406: POT2.2 64.77,48.26 66.04,49.53 66.04,54.61 67.31,55.88 67.31,62.23 66.04,63.5
N$38  (via drill 0.6)  (1 unrouted)
  Top 0.406: v34.29,57.15 34.29,55.88 33.02,54.61 SW1.12
  Bottom 0.406: 12.7,59.69 13.97,58.42 33.02,58.42 v34.29,57.15
N$39  (via drill 0.6)  (1 unrouted)
  Top 0.406: v21.59,59.69 SW1.1
  Bottom 0.406: 10.16,62.23 11.43,63.5 13.97,63.5 15.24,62.23 15.24,60.96 16.51,59.69 v21.59,59.69
N$40  (via drill 0.6)  (1 unrouted)
  Top 0.406: v26.67,57.15 SW1.14
  Bottom 0.406: 12.7,55.88 13.97,57.15 v26.67,57.15
N$41  (via drill 0.6)  (1 unrouted)
  Top 0.406: 10.16,55.88 11.43,57.15 13.97,57.15 15.24,55.88 v15.24,54.61 | v21.59,54.61 SW1.5
  Bottom 0.406: v15.24,54.61 v21.59,54.61
N$42  (via drill 0.6)  (1 unrouted)
  Top 0.406: v36.83,48.26 36.83,57.15 35.56,58.42 SW1.15
N$43  (1 unrouted)
  Top 0.406: 10.16,49.53 11.43,50.8 15.24,50.8 16.51,52.07 16.51,57.15 17.78,58.42 SW1.2
N$44  (via drill 0.6)  (1 unrouted)
  Top 0.406: v35.56,46.99 35.56,52.07 34.29,53.34 SW1.11 | 13.97,41.91 15.24,43.18 v15.24,46.99
  Bottom 0.406: v15.24,46.99 v35.56,46.99
N$45  (via drill 0.6)  (1 unrouted)
  Top 0.406: v19.05,44.45 19.05,54.61 20.32,55.88 SW1.4
  Bottom 0.406: v19.05,44.45 11.43,44.45 10.16,43.18
N$46  (via drill 0.6)  (1 unrouted)
  Top 0.406: v26.67,35.56 26.67,38.1 27.94,39.37 SW2.14
N$47  (via drill 0.6)  (1 unrouted)
  Top 0.406: v20.32,36.83 SW2.5 | 10.16,36.83 11.43,38.1 v13.97,38.1
  Bottom 0.406: v13.97,38.1 19.05,38.1 v20.32,36.83
N$48  (via drill 0.6)  (1 unrouted)
  Top 0.406: v38.1,29.21 38.1,39.37 36.83,40.64 SW2.15
N$49  (1 unrouted)
  Top 0.406: 10.16,30.48 11.43,31.75 13.97,31.75 15.24,33.02 15.24,39.37 16.51,40.64 SW2.2
N$50  (via drill 0.6)  (1 unrouted)
  Top 0.406: SW2.11 34.29,35.56 35.56,34.29 v35.56,27.94
  Bottom 0.406: 17.78,22.86 19.05,24.13 19.05,26.67 20.32,27.94 v35.56,27.94
N$51  (via drill 0.6)  (1 unrouted)
  Top 0.406: v17.78,25.4 17.78,36.83 19.05,38.1 SW2.4
  Bottom 0.406: 10.16,24.13 11.43,25.4 v17.78,25.4
N$53  (2 unrouted)
N$54  (2 unrouted)
N$55  (2 unrouted)
N$56  (3 unrouted)
N$57  (2 unrouted)
N$58  (2 unrouted)
N$59  (2 unrouted)
N$60  (2 unrouted)
N$61  (3 unrouted)
N$62  (2 unrouted)
N$64  (1 unrouted)
N$65  (3 unrouted)
N$66  (2 unrouted)
N$67  (2 unrouted)
N$68  (2 unrouted)
N$69  (2 unrouted)
N$70  (2 unrouted)
N$71  (2 unrouted)
N$72  (2 unrouted)
N$73  (2 unrouted)
N$74  (2 unrouted)
N$75  (3 unrouted)
N$76  (2 unrouted)
N$77  (2 unrouted)
N$78  (2 unrouted)
N$79  (2 unrouted)
N$80  (2 unrouted)
N$81  (1 unrouted)
R_IN  (1 unrouted)
R_OUT  (2 unrouted)
SUB_IN  (2 unrouted)
SUB_OUT  (2 unrouted)
SUB_OUT-180  (4 unrouted)
SUB_OUT_1  (2 unrouted)
SUB_OUT_2  (1 unrouted)
V+  (2 unrouted)
V-  (2 unrouted)

### Text on the board
tNames: A0 A1 | A0 A1 | CS1 CS2 | SCK | SI1 SO1 SI2 SO2 | Pot1 | Pot2 | Vcc GND | Audioeingänge